# Altium schematic sheet Power_Selector.SchDoc
size A4; SheetNumber: 11; SheetTotal: 12
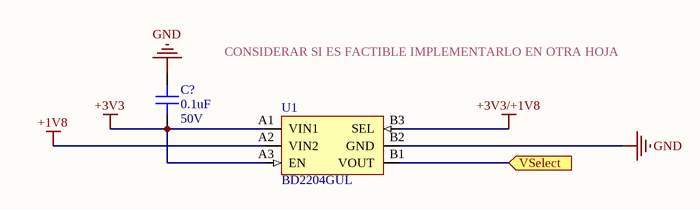
[diagram p0: Power_Selector.SchDoc]

## Parts
C?  0.1uF  Voltage: 50V  [CAP0603]
U1  BD2204GUL  [UFBGA-6 (VCSP50L1)]

## Ports
VSelect (in)

## Nets
+1V8: U1.A2(VIN2)
+3V3: C?.1 U1.A1(VIN1) U1.A3(EN)
+3V3/+1V8: U1.B3(SEL)
GND: C?.2 U1.B2(GND)
VSelect: U1.B1(VOUT) ; port VSelect

## Notes on the sheet
- CONSIDERAR SI ES FACTIBLE IMPLEMENTARLO EN OTRA HOJA

## Library data of the parts
C? = C0603C104K4RAC7867: CAP CER 0.1UF 16V X7R 0603; ComponentLink1Description: DataSheet; ComponentLink1URL: https://content.kemet.com/datasheets/KEM_C1002_X7R_SMD.pdf; Size: 0603; ComponentLink2Description: DigiKey; ComponentLink2URL: https://www.digikey.com/en/products/detail/kemet/C0603C104K4RAC7867/411095
U1 = BD2204GUL: Power Supply Selector Switch IC for SD Cards; Manufacturer: ROHM; PartNumber: BD2204GUL; Package: UFBGA-6; ComponentLink1Description: Productrpage; ComponentLink1URL: https://www.rohm.com/products/power-management/power-management-switch-ics/load-switch-ics/bd2204gul-product; ComponentLink2Description: DataSheet; ComponentLink2URL: https://fscdn.rohm.com/en/products/databook/datasheet/ic/power/power_switch/bd2204gul-e.pdf; ComponentLink3Description: DigiKey; ComponentLink3URL: https://www.digikey.com/en/products/detail/rohm-semiconductor/BD2204GUL-E2/5210337